# EAGLE design FIDO2AUTH_00211 (EAGLE 7.7.0)

## Sheet 1 of 4
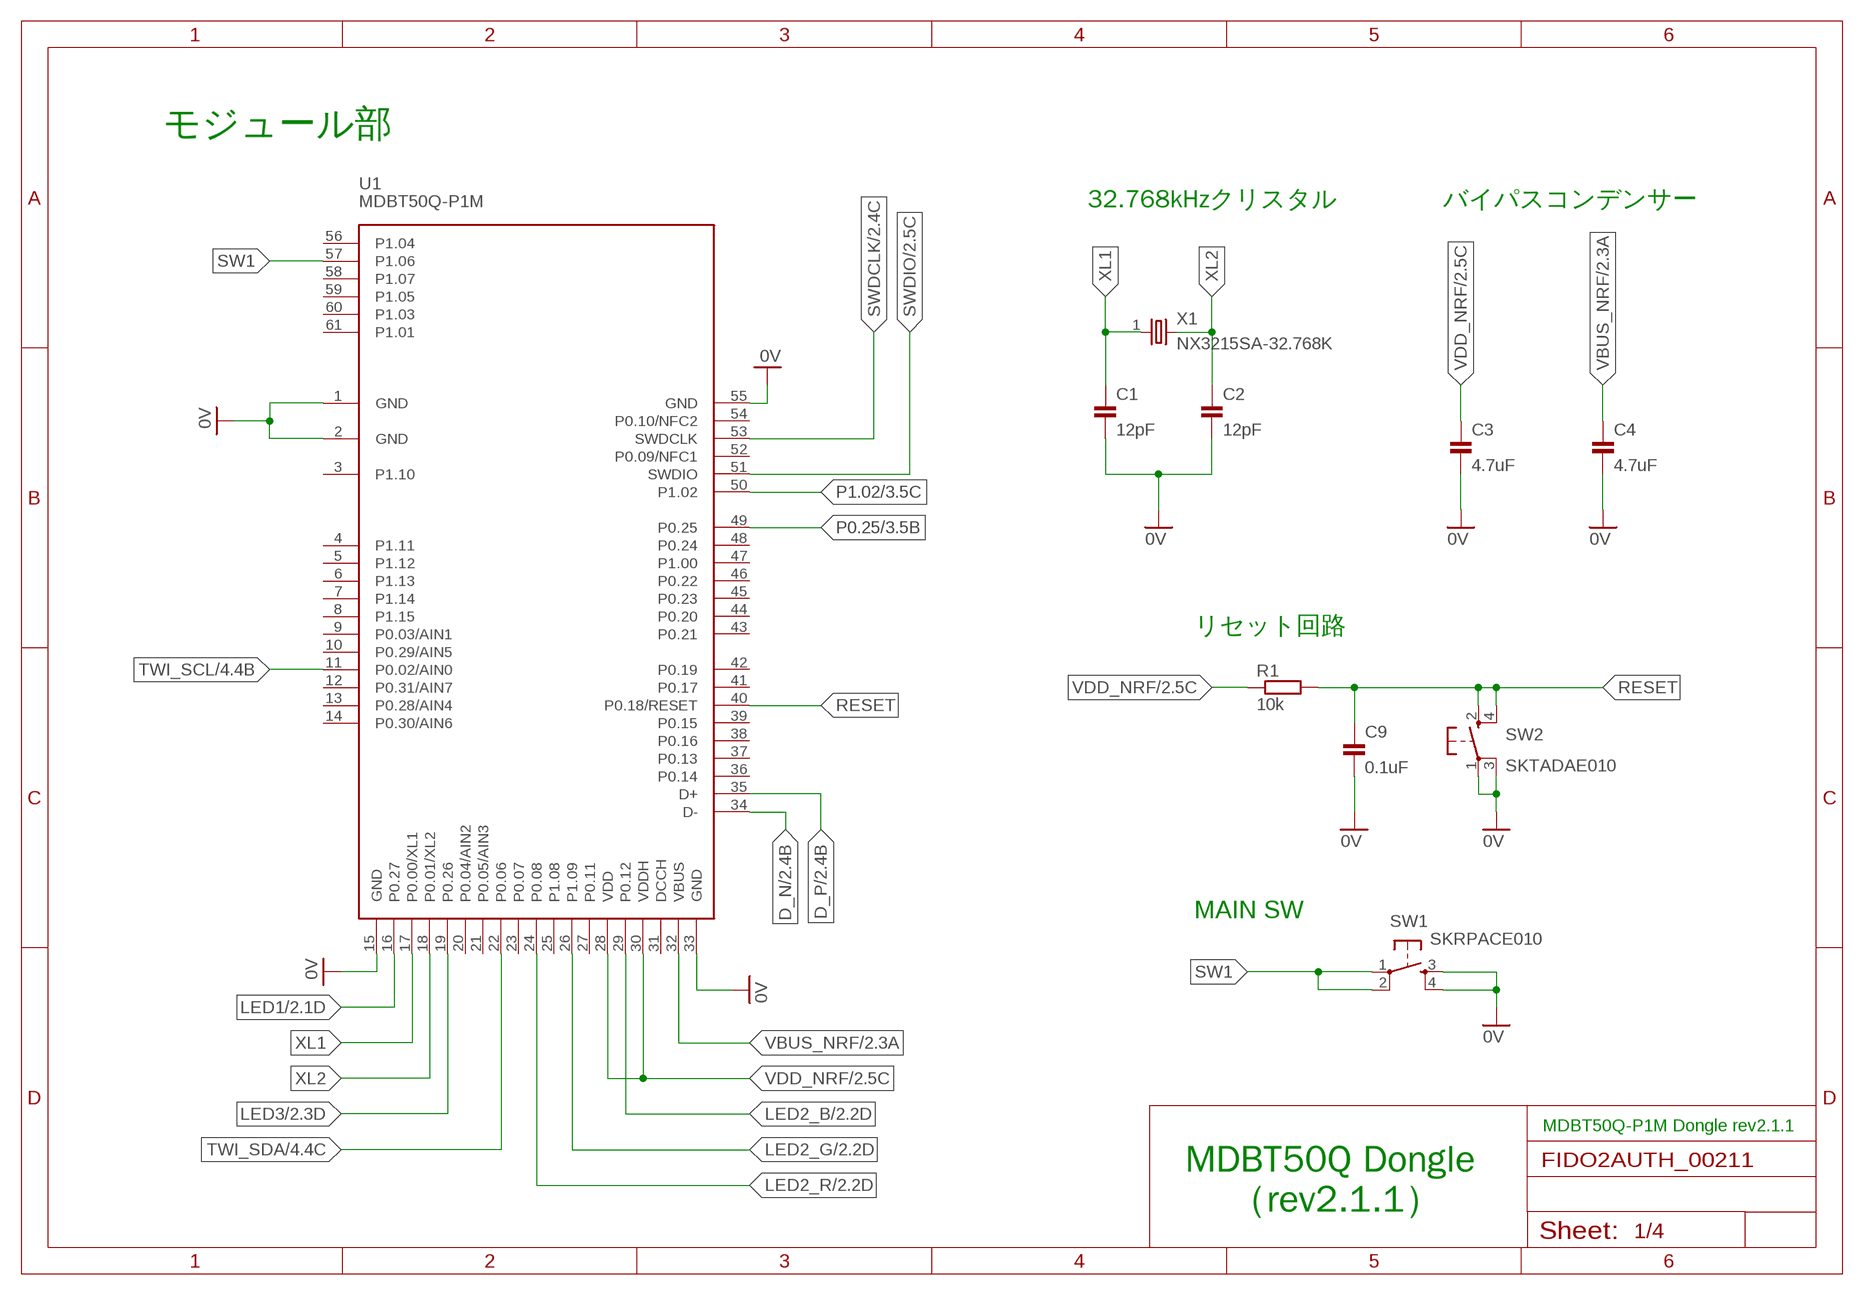
[diagram p0: schematic, sheet 1]

### Parts
C1  12pF  CAP_0603  [C0603K]
C2  12pF  CAP_0603  [C0603K]
C3  4.7uF  CAP_0603  [C0603K]
C4  4.7uF  CAP_0603  [C0603K]
C9  0.1uF  CAP_0402K  [C0402K]
R1  10k  RESISTOR_0402  [R0402]
SW1  SKRPACE010  [SKRPACE010]
SW2  SKTADAE010  [SKTADAE010]
U1  MDBT50Q-P1M  [MDBT50Q-P1M]
X1  NX3215SA-32.768K  [NX3215]

### Nets
0V: C1.2 C2.2 C3.2 C4.2 C9.2 SW1.3(S) SW1.4(S1) SW2.1(P) SW2.3(P1) U1.1(GND) U1.2(GND) U1.15(GND) U1.33(GND) U1.55(GND) ; also sheet 2,3,4
D_N: U1.34(D-) ; also sheet 2
D_P: U1.35(D+) ; also sheet 2
LED1: U1.16(P0.27) ; also sheet 2
LED2_B: U1.29(P0.12) ; also sheet 2
LED2_G: U1.26(P1.09) ; also sheet 2
LED2_R: U1.24(P0.08) ; also sheet 2
LED3: U1.19(P0.26) ; also sheet 2
P0.25: U1.49(P0.25) ; also sheet 3
P1.02: U1.50(P1.02) ; also sheet 3
RESET: C9.1 R1.2 SW2.2(S) SW2.4(S1) U1.40(P0.18/RESET)
SW1: SW1.1(P) SW1.2(P1) U1.57(P1.06)
SWDCLK: U1.53(SWDCLK) ; also sheet 2
SWDIO: U1.51(SWDIO) ; also sheet 2
TWI_SCL: U1.11(P0.02/AIN0) ; also sheet 4
TWI_SDA: U1.22(P0.06) ; also sheet 4
VBUS_NRF: C4.1 U1.32(VBUS) ; also sheet 2,3
VDD_NRF: C3.1 R1.1 U1.28(VDD) U1.30(VDDH) ; also sheet 2,3,4
XL1: C1.1 U1.17(P0.00/XL1) X1.1
XL2: C2.1 U1.18(P0.01/XL2) X1.2
Unconnected: U1.3(P1.10) U1.4(P1.11) U1.5(P1.12) U1.6(P1.13) U1.7(P1.14) U1.8(P1.15) U1.9(P0.03/AIN1) U1.10(P0.29/AIN5) U1.12(P0.31/AIN7) U1.13(P0.28/AIN4) U1.14(P0.30/AIN6) U1.20(P0.04/AIN2) U1.21(P0.05/AIN3) U1.23(P0.07) U1.25(P1.08) U1.27(P0.11) U1.31(DCCH) U1.36(P0.14) U1.37(P0.13) U1.38(P0.16) U1.39(P0.15) U1.41(P0.17) U1.42(P0.19) U1.43(P0.21) U1.44(P0.20) U1.45(P0.23) U1.46(P0.22) U1.47(P1.00) U1.48(P0.24) U1.52(P0.09/NFC1) U1.54(P0.10/NFC2) U1.56(P1.04) U1.58(P1.07) U1.59(P1.05) U1.60(P1.03) U1.61(P1.01)

### Notes on the sheet
- モジュール部
- 32.768kHzクリスタル | バイパスコンデンサー
- リセット回路
- MAIN SW
- MDBT50Q-P1M Dongle rev2.1.1
- MDBT50Q Dongle
      （rev2.1.1）

## Sheet 2 of 4
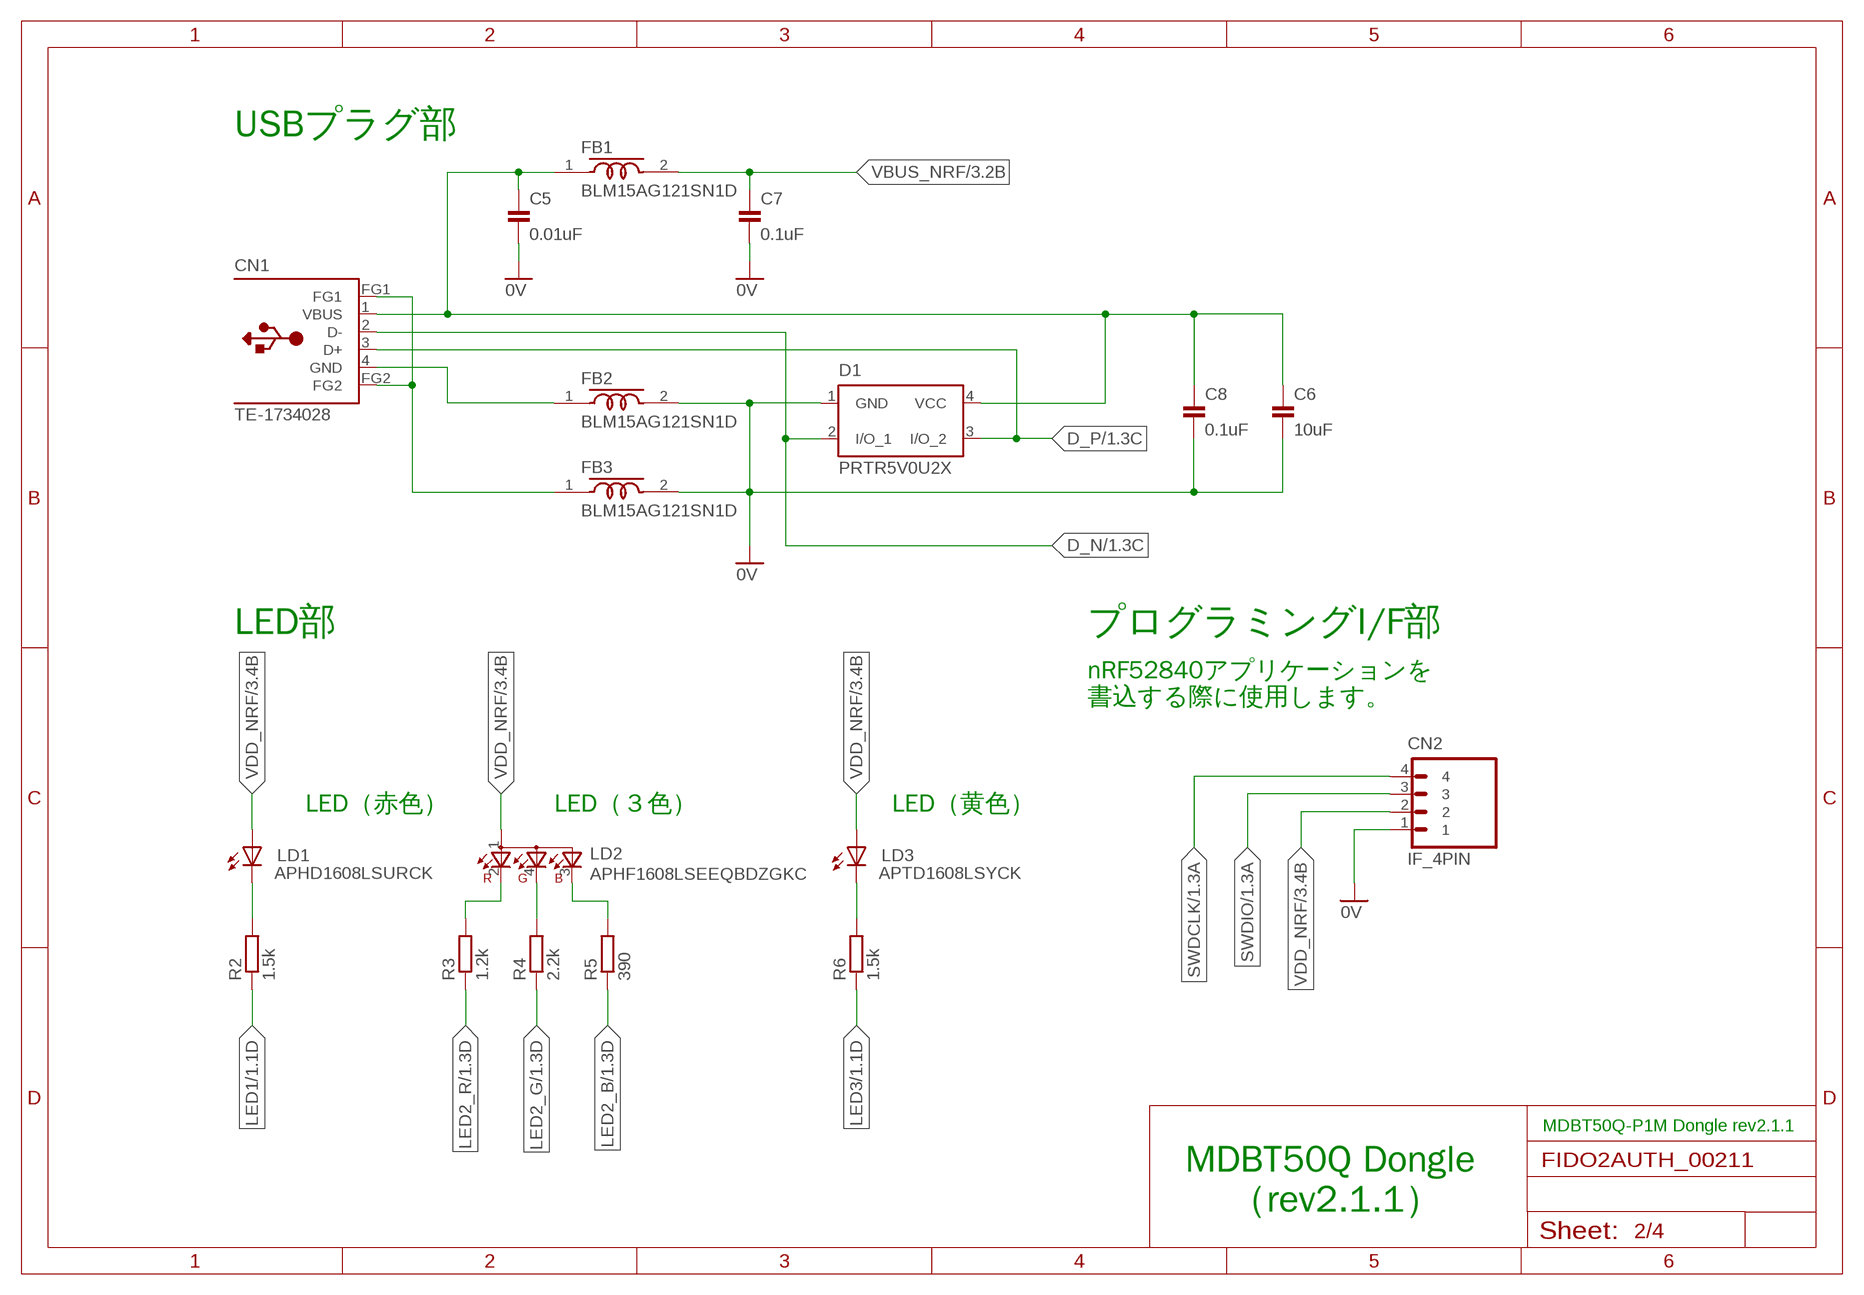
[diagram p1: schematic, sheet 2]

### Parts
C5  0.01uF  CAP_0402K  [C0402K]
C6  10uF  CAP_0603  [C0603K]
C7  0.1uF  CAP_0402K  [C0402K]
C8  0.1uF  CAP_0402K  [C0402K]
CN1  TE-1734028  [TE-1734028]
CN2  IF_4PIN  [HEADER_4PIN]
D1  PRTR5V0U2X  [SOT143B]
FB1  BLM15AG121SN1D  [C0402K]
FB2  BLM15AG121SN1D  [C0402K]
FB3  BLM15AG121SN1D  [C0402K]
LD1  APHD1608LSURCK  [CHIPLED_0603]
LD2  APHF1608LSEEQBDZGKC  [APHF1608LSEEQBDZGKC]
LD3  APTD1608LSYCK  [CHIPLED_0603]
R2  1.5k  RESISTOR_0402  [R0402]
R3  1.2k  RESISTOR_0402  [R0402]
R4  2.2k  RESISTOR_0402  [R0402]
R5  390  RESISTOR_0402  [R0402]
R6  1.5k  RESISTOR_0402  [R0402]

### Nets
0V: C5.2 C6.2 C7.2 C8.2 CN2.1 D1.1(GND) FB2.2 FB3.2 ; also sheet 1,3,4
D_N: CN1.2(D-) D1.2(I/O_1) ; also sheet 1
D_P: CN1.3(D+) D1.3(I/O_2) ; also sheet 1
LED1: R2.1 ; also sheet 1
LED2_B: R5.1 ; also sheet 1
LED2_G: R4.1 ; also sheet 1
LED2_R: R3.1 ; also sheet 1
LED3: R6.1 ; also sheet 1
N$1: LD2.2(CRED) R3.2
N$2: CN1.4(GND) FB2.1
N$3: CN1.FG1 CN1.FG2 FB3.1
N$6: LD2.4(CGREEN) R4.2
N$7: LD2.3(CBLUE) R5.2
N$8: LD3.C R6.2
N$11: LD1.C R2.2
SWDCLK: CN2.4 ; also sheet 1
SWDIO: CN2.3 ; also sheet 1
VBUS: C5.1 C6.1 C8.1 CN1.1(VBUS) D1.4(VCC) FB1.1
VBUS_NRF: C7.1 FB1.2 ; also sheet 1,3
VDD_NRF: CN2.2 LD1.A LD2.1(A) LD3.A ; also sheet 1,3,4

### Notes on the sheet
- USBプラグ部
- LED部 | プログラミングI/F部
- nRF52840アプリケーションを
  書込する際に使用します。
- LED（赤色） | LED（３色） | LED（黄色）
- MDBT50Q-P1M Dongle rev2.1.1
- MDBT50Q Dongle
      （rev2.1.1）

## Sheet 3 of 4
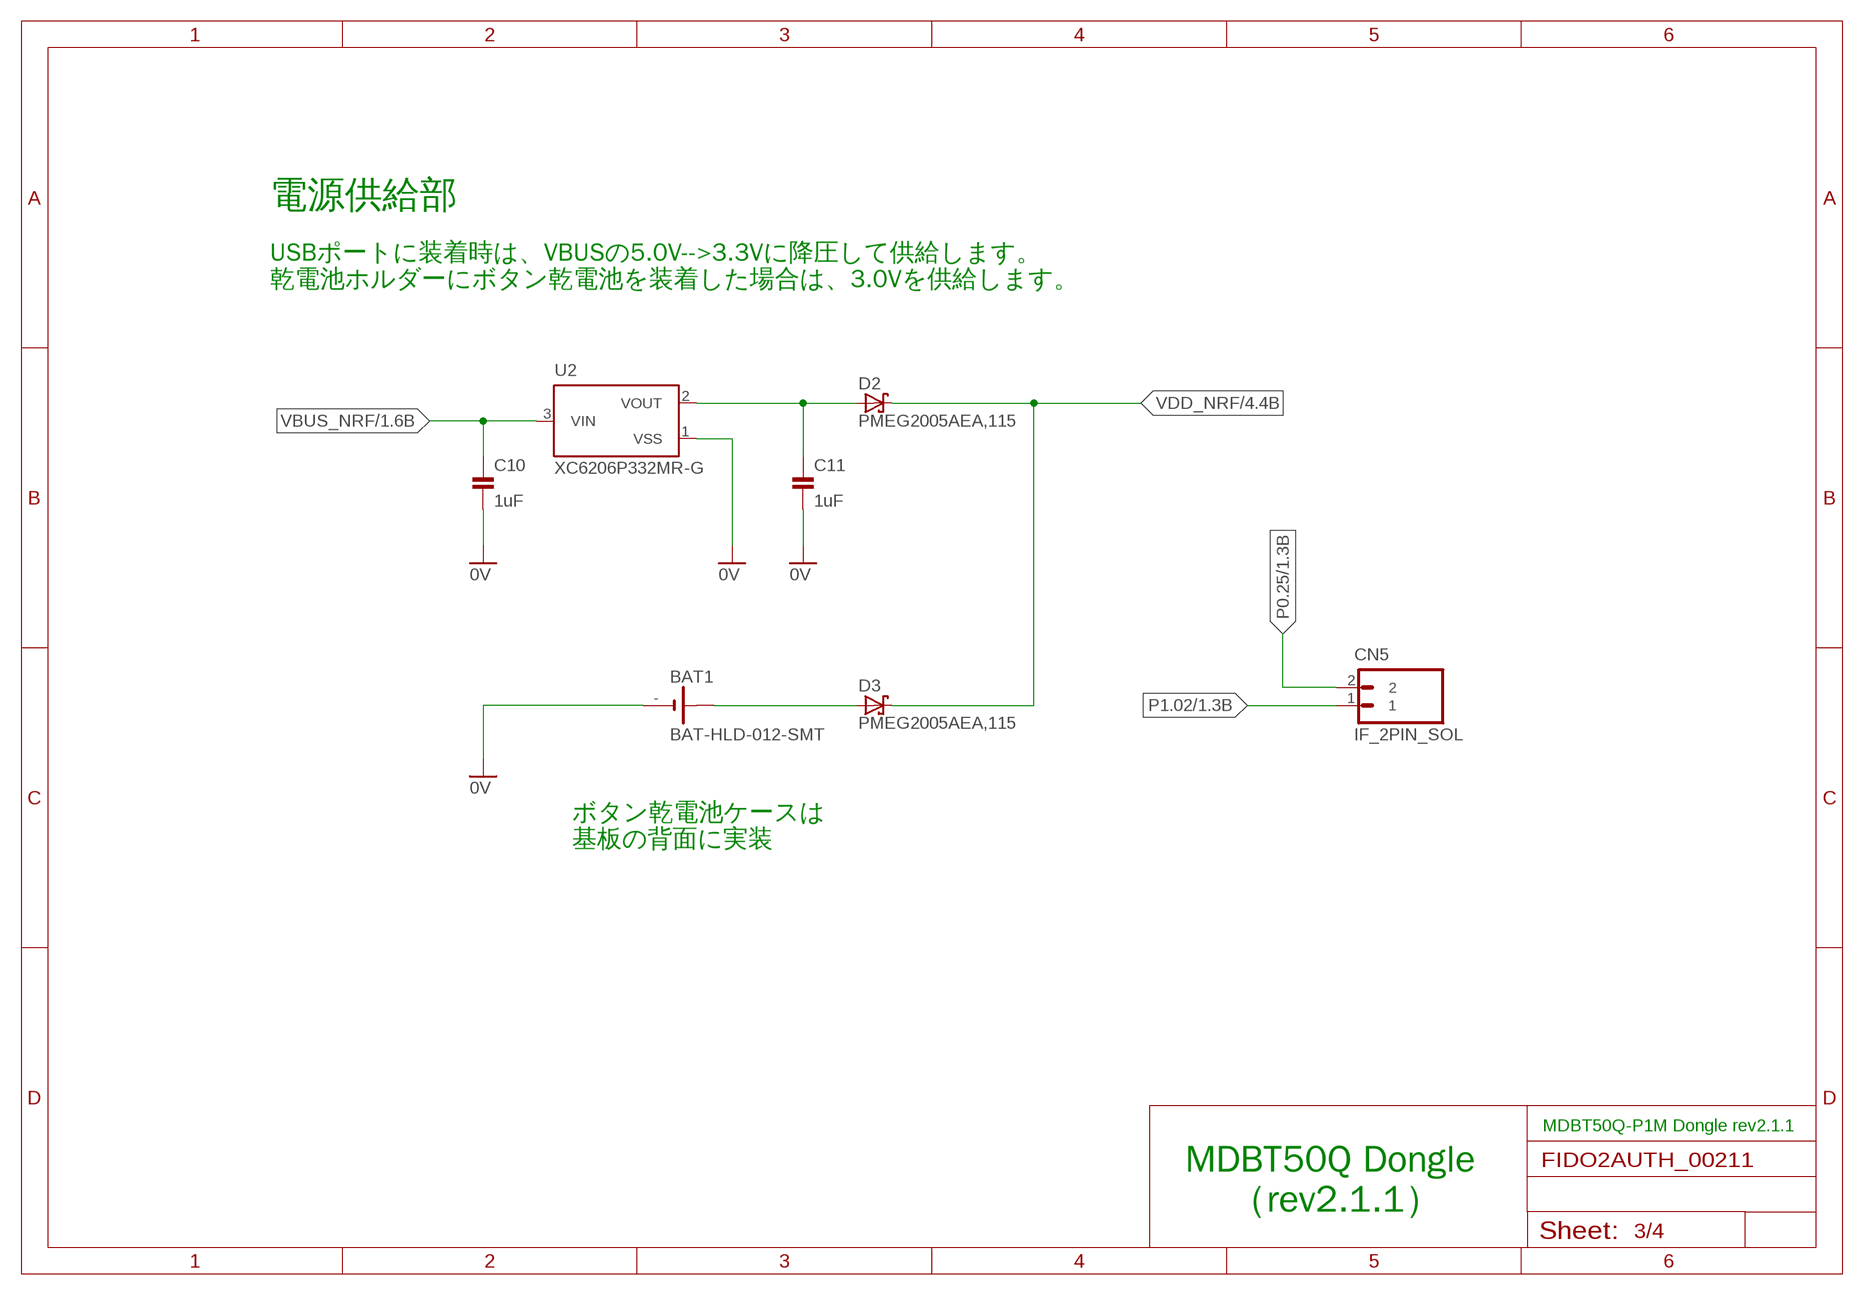
[diagram p2: schematic, sheet 3]

### Parts
BAT1  BAT-HLD-012-SMT  [BAT-HLD-012-SMT]
C10  1uF  CAP_0603  [C0603K]
C11  1uF  CAP_0603  [C0603K]
CN5  IF_2PIN_SOL  [SOLPAD_2PIN]
D2  PMEG2005AEA,115  [SOD323-W]
D3  PMEG2005AEA,115  [SOD323-W]
U2  XC6206P332MR-G  [SOT23]

### Nets
0V: BAT1.- C10.2 C11.2 U2.1(VSS) ; also sheet 1,2,4
N$4: C11.1 D2.A U2.2(VOUT)
N$5: BAT1.+@1(+) D3.A
P0.25: CN5.2 ; also sheet 1
P1.02: CN5.1 ; also sheet 1
VBUS_NRF: C10.1 U2.3(VIN) ; also sheet 1,2
VDD_NRF: D2.C D3.C ; also sheet 1,2,4

### Notes on the sheet
- 電源供給部
- USBポートに装着時は、VBUSの5.0V-->3.3Vに降圧して供給します。
  乾電池ホルダーにボタン乾電池を装着した場合は、3.0Vを供給します。
- ボタン乾電池ケースは
  基板の背面に実装
- MDBT50Q-P1M Dongle rev2.1.1
- MDBT50Q Dongle
      （rev2.1.1）

## Sheet 4 of 4
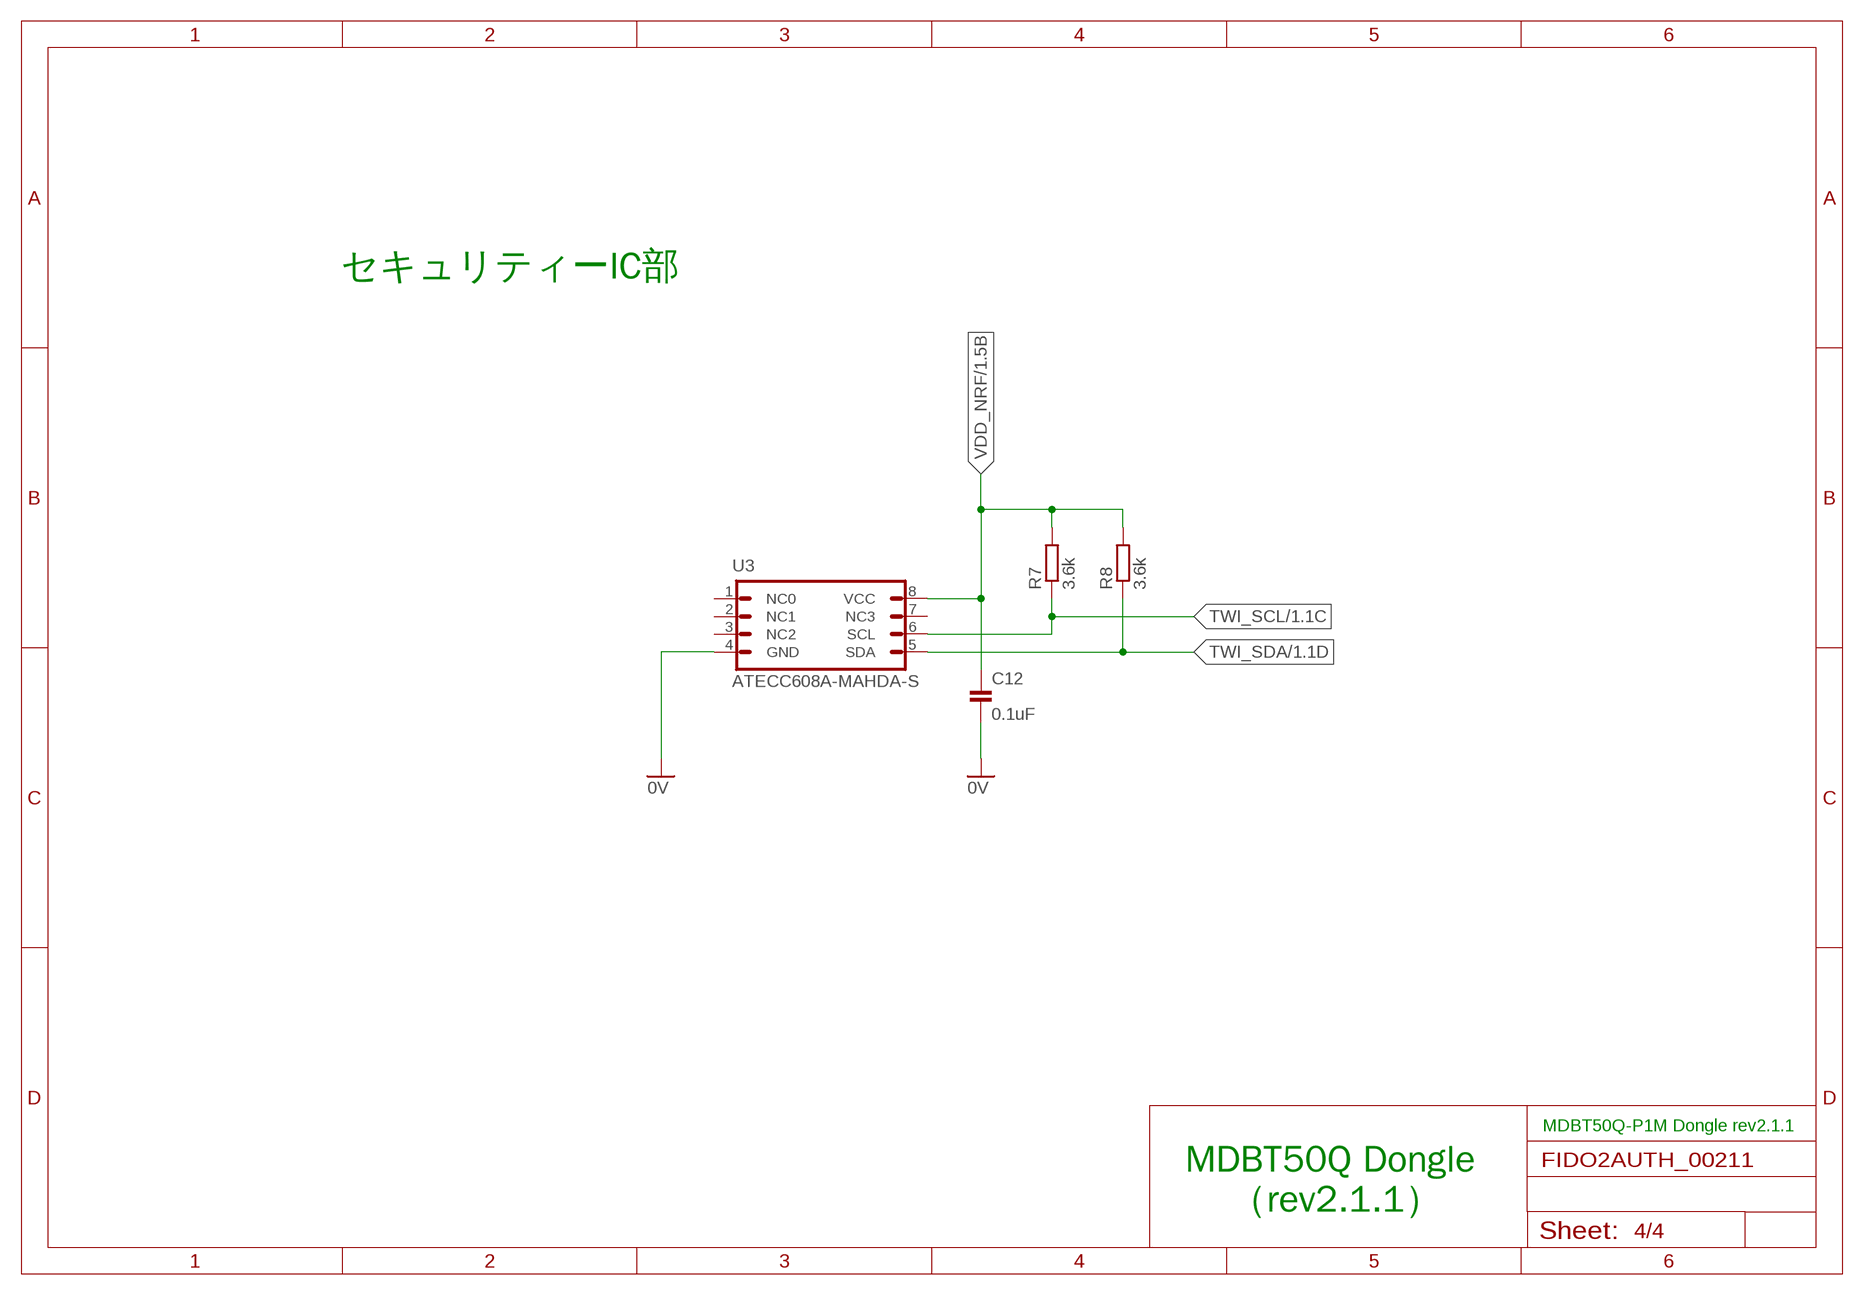
[diagram p3: schematic, sheet 4]

### Parts
C12  0.1uF  CAP_0402K  [C0402K]
R7  3.6k  RESISTOR_0402  [R0402]
R8  3.6k  RESISTOR_0402  [R0402]
U3  ATECC608A-MAHDA-S  [DFN-2X3]

### Nets
0V: C12.2 U3.4(GND) ; also sheet 1,2,3
TWI_SCL: R7.1 U3.6(SCL) ; also sheet 1
TWI_SDA: R8.1 U3.5(SDA) ; also sheet 1
VDD_NRF: C12.1 R7.2 R8.2 U3.8(VCC) ; also sheet 1,2,3
Unconnected: U3.1(NC0) U3.2(NC1) U3.3(NC2) U3.7(NC3)

### Notes on the sheet
- セキュリティーIC部
- MDBT50Q-P1M Dongle rev2.1.1
- MDBT50Q Dongle
      （rev2.1.1）

## Library data of the parts
BAT1 = Connectors:BAT-HLD-012-SMT: ボタン電池ホルダー(CR1216/1225)
C1-C12 = Parts:CAP: コンデンサー
CN1 = Connectors:TE-1734028: USB connector plug TE Connectivity
CN2 = Connectors:IF_4PIN: 4-pin インターフェース
CN5 = Connectors:IF_2PIN: 2-pin インターフェース
D1 = Parts:PRTR5V0U2X: ESD protection diode
D2 D3 = Parts:PMEG2005: ショットキーダイオード If - 順電流: 500 mA Vrrm - 繰返し逆電圧: 20 V Vf - 順電圧: 0.39 V Ifsm - 順方向サージ電流: 10 A 最低動作温度: - 65 C 最高動作温度: + 150 C
FB1-FB3 = Parts:BLM15AG: フェライトビーズ EMIFIL®
LD1 = Parts:APHD1608: 発光ダイオード
LD2 = Parts:APHF1608: Chip LED RGB Source: http://document.sharpsma.com/files/GM1WA55311A_SS.pdf
LD3 = Parts:APTD1608: 発光ダイオード
R1-R8 = Parts:RESISTOR: 抵抗器
SW1 = Parts:SKRPACE010: 表面実装用タクトスイッチ ４．２×３．２ｍｍ小型重作動力タイプ ・作動力：２．５５Ｎ ・操作方向：垂直 ・移動量：０．２ｍｍ ・動作寿命：５０，０００ｃｙｃｌｅｓ （５ｍＡ ５ＶＤＣ） ・初期接触抵抗：最大５００ｍΩ
SW2 = Parts:SKTADAE010: 表面実装用タクトスイッチ 2.6×1.6ｍｍ小型重作動力タイプ ・作動力：2.4 N ・操作方向：垂直 ・移動量：0.11 mm ・定格：50 mA 12 VDC
U1 = Modules:MDBT50Q-P1M: MDBT50Q – P1M (PCB Antenna) Bluetooth 5, IEEE 802.15.4, 2.4 GHz transceiver ARM Cortex –M4 32-bit processor with FPU, 64 MHz Memory: 1MB flash / 256KB RAM ‧Supply voltage range 1.7V to 5.5V ‧On-chip DC/DC and LDO regulators with automated low current modes ‧Regulated supply for external components from 1.8V to 3.3V ‧0.4uA at 3V in System OFF mode, no RAM retention ‧1.5uA at 3V in System ON mode, no RAM retention, wake on RTC Working distance 1Mbps: up to 250 meters in open space 2Mbps: up to 120 meters in open space
U2 = Parts:XC6206: LDO電圧レギュレータ 出力電圧: 3.3 V 出力電流: 200 mA 入力電圧最大値: 6 V 最小入力電圧: 1.8 V 動作供給電流: 1 uA 最低動作温度: - 40 C 最高動作温度: + 85 C
U3 = ICs:ATECC608A: high-security cryptographic device 供給電圧: 2 〜 5.5 V 動作温度: - 40 C 〜 + 85 C 供給電流 - 最大: 14 mA 動作供給電流: 2 mA
X1 = Parts:NX3215SA: 水晶振動子 周波数 32.768kHz 周波数公差 ±20ppm 負荷容量 6pF ESR（等価直列抵抗） 70 kOhms 動作温度 -40°C～85°C

## Board
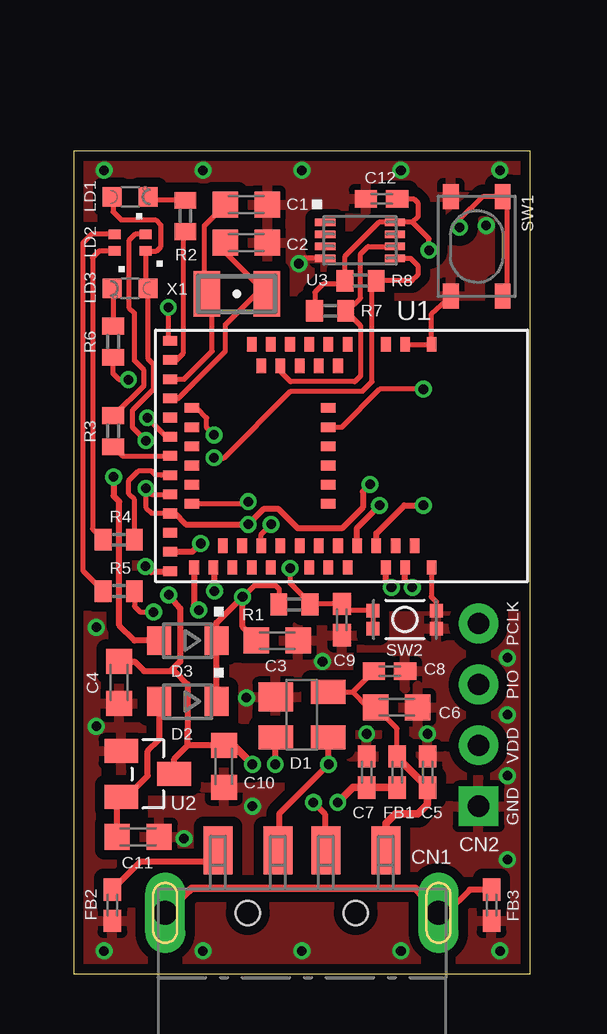
[diagram p4: board, top side]
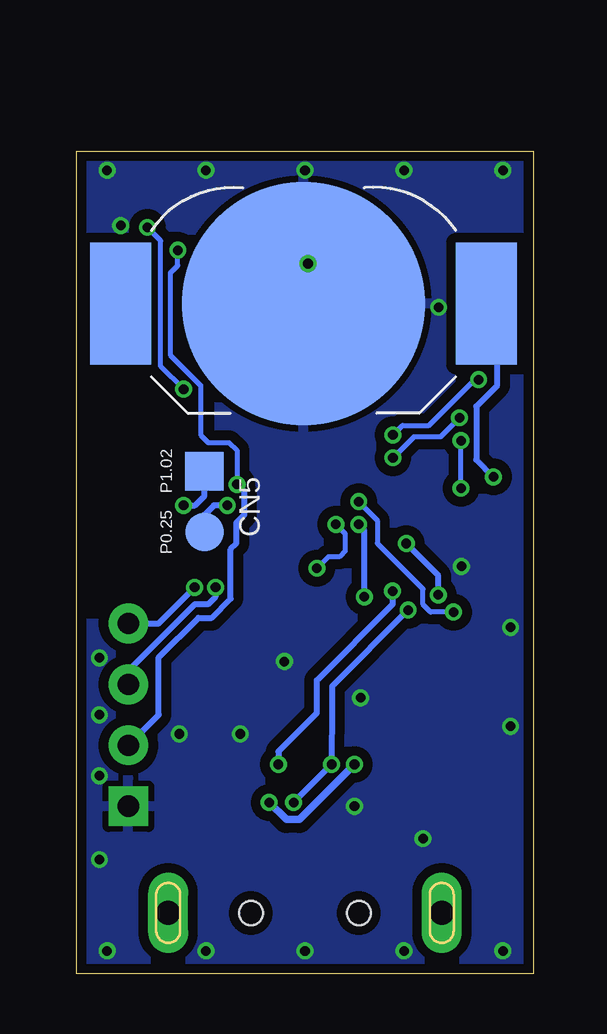
[diagram p5: board, bottom side, seen from below]

Size 19.05 x 34.29 mm. Coordinates in mm from the lower left corner, seen from the top.
Outline: 0,0 19.05,0 19.05,34.29 0,34.29 0,0
Copper layers (1*16): Top 0.035mm / dielectric 1.5mm / Bottom 0.035mm
Design rules "SeeedStudio_2layer_DRU_no_angle_20140221": minimum track width 6mil, minimum drill 12mil, track to track 6mil, track to pad 6mil, pad to pad 6mil, via to via 6mil, smd to smd 0mil, copper to edge 10mil, drill to drill 10mil, minimum pad ring 10mil, minimum via ring 6mil, stop-mask expansion 2mil, vias tented up to drill 100mil, thermal gap 10mil

### Footprints (pad centres in the part's own frame; a part is rotated, then mirrored left to right if it is on the bottom)
BAT-HLD-012-SMT = smd 2.54 x 5.08: +@1 -7.62,0; +@2 7.62,0 | smd 10.16 x 10.16: - 0,0
C0603K = smd 1.05 x 1.08: 1 -0.875,0; 2 0.875,0
C0402K = smd 0.925 x 0.74: 1 -0.65,0; 2 0.65,0
TE-1734028 = smd 1.2 x 2: 1 3.5,2.6; 2 1,2.6; 3 -1,2.6; 4 -3.5,2.6 | drill 1 pad 1.676 long: FG1 5.7,0; FG2 -5.7,0 | hole 1: -2.25,0; 2.25,0
HEADER_4PIN = drill 0.889 pad 1.651 square: 1 0,0 | drill 0.889 pad 1.651: 2 2.54,0; 3 5.08,0; 4 7.62,0
SOLPAD_2PIN = smd 1.6 x 1.6: 1 0,0; 2 2.54,0
SOT143B = smd 1.2 x 1.44: 1 -0.75,-1.1 | smd 1 x 1.44: 2 0.95,-1.1; 3 0.95,1.1; 4 -0.95,1.1
SOD323-W = smd 1 x 1.2: A 1.2,0; C -1.2,0
CHIPLED_0603 = smd 0.8 x 0.8: A -0.75,0; C 0.75,0
APHF1608LSEEQBDZGKC = smd 0.5 x 0.4: 1 -0.65,0.35; 2 -0.65,-0.35; 3 0.65,-0.35; 4 0.65,0.35
R0402 = smd 0.7 x 0.9: 1 -0.65,0; 2 0.65,0
SKRPACE010 = smd 1.05 x 0.65: 1 -2.075,1.075; 2 2.075,1.075; 3 -2.075,-1.075; 4 2.075,-1.075
SKTADAE010 = smd 0.55 x 0.55: 1 -1.325,0.375; 2 1.325,0.375; 3 -1.325,-0.375; 4 1.325,-0.375
MDBT50Q-P1M = smd 0.6 x 0.4: 1 -4.65,3.75; 2 -4.65,2.65; 3 -4.65,1.85; 4 -4.65,0.25; 5 -3.75,-0.15; 6 -4.65,-0.55; 7 -3.75,-0.95; 8 -4.65,-1.35; 9 -3.75,-1.75; 10 -4.65,-2.15; 11 -3.75,-2.55; 12 -4.65,-2.95; 13 -3.75,-3.35; 14 -4.65,-3.75; 34 4.65,-6.15; 35 4.65,-5.35; 36 3.75,-4.95; 37 4.65,-4.55; 38 3.75,-4.15; 39 4.65,-3.75; 40 3.75,-3.35; 41 4.65,-2.95; 42 3.75,-2.55; 43 3.75,-1.75; 44 4.65,-1.35; 45 3.75,-0.95; 46 4.65,-0.55; 47 3.75,-0.15; 48 4.65,0.25; 49 3.75,0.65; 50 3.75,1.45; 51 4.65,1.85; 52 3.75,2.25; 53 4.65,2.65; 54 3.75,3.05; 55 4.65,3.75 | smd 0.4 x 0.6: 15 -4.8,-7.15; 16 -4,-7.15; 17 -3.2,-7.15; 18 -2.4,-7.15; 19 -2,-6.25; 20 -1.6,-7.15; 21 -1.2,-6.25; 22 -0.8,-7.15; 23 -0.4,-6.25; 24 0,-7.15; 25 0.4,-6.25; 26 0.8,-7.15; 27 1.2,-6.25; 28 1.6,-7.15; 29 2,-6.25; 30 2.4,-7.15; 31 3.2,-7.15; 32 4,-7.15; 33 4.8,-7.15; 56 -2,-0.55; 57 -1.2,-0.55; 58 -0.4,-0.55; 59 0.4,-0.55; 60 1.2,-0.55; 61 2,-0.55
SOT23 = smd 1 x 1.4: 1 -0.95,-1.1; 2 0.95,-1.1; 3 0,1.1
DFN-2X3 = smd 0.3 x 0.85: 1 -0.75,-1.45; 2 -0.25,-1.45; 3 0.25,-1.45; 4 0.75,-1.45; 5 0.75,1.45; 6 0.25,1.45; 7 -0.25,1.45; 8 -0.75,1.45
NX3215 = smd 1.1 x 1.9: 1 -1.25,0; 2 1.25,0

### Placement (x,y rotation side)
BAT1  9.59,27.94 180 bottom
C1  7.21,32.07 0 top
C2  7.21,30.48 0 top
C3  8.49,13.89 0 top
C4  1.91,12.14 270 top
C5  14.76,8.41 90 top
C6  13.48,11.11 0 top
C7  12.22,8.41 90 top
C8  13.18,12.62 0 top
C9  11.19,14.76 270 top
C10  6.27,8.65 270 top
C11  2.7,5.71 0 top
C12  12.84,32.31 180 top
CN1  9.53,2.54 0 top
CN2  16.89,6.99 90 top
CN5  13.72,20.95 270 bottom
D1  9.53,10.79 270 top
D2  4.76,11.35 180 top
D3  4.76,13.89 180 top
FB1  13.49,8.41 270 top
FB2  1.62,2.86 270 top
FB3  17.43,2.86 270 top
LD1  2.37,32.38 0 top
LD2  2.37,30.48 180 top
LD3  2.37,28.57 180 top
R1  9.21,15.4 0 top
R2  4.67,31.59 90 top
R3  1.65,22.62 90 top
R4  1.89,18.1 180 top
R5  1.89,15.95 180 top
R6  1.65,26.35 90 top
R7  10.7,27.64 180 top
R8  11.97,28.89 180 top
SW1  16.81,30.32 270 top
SW2  13.81,14.76 180 top
U1  11.18,21.59 270 top
U2  3.1,8.33 270 top
U3  11.95,30.58 270 top
X1  6.81,28.34 0 top

### Tracks (layer width: path | path; a pad name or v marks a point on that pad's centre or on a via)
0V  (via drill 0.4)
  Top 0.203: 4.06,26.35 U1.15 3.95,26.46 v3.95,27.78 | U1.2 U1.1 14.93,27.52 SW1.4 | SW2.3 15.14,15.5 14.92,15.72 14.93,15.72 U1.55 | 3.98,16.75 U1.33 | U3.4 9.62,29.82 v9.4,29.61
  Top 0.254: 3.98,16.75 3.24,16.75 v3,16.99
  other vias: 9.53,0.95 10.38,13.02 13.65,0.95 5.4,0.95 4.6,5.64 18.1,4.76 18.1,10.79 17.78,0.95 1.27,0.95 7.46,6.99 18.1,13.18 7.21,11.51 1.27,33.5 18.1,8.26 17.21,31.19 5.4,33.5 9.53,33.5 17.78,33.5 13.65,33.5 12.22,10 14.76,10 0.95,10.32 0.95,14.45
  pour Bottom (isolate 0.406, rank 3): -2.54,-2.54 21.59,-2.54 21.59,14.61 14.35,14.61 14.35,21.59 13.08,21.59 13.08,24.77 14.35,24.77 14.35,28.57 21.59,28.57 21.59,36.83 -2.54,36.83
  pour Top (isolate 0.406, rank 3): -1.27,35.56 20.32,35.56 20.32,28.26 2.92,28.26 2.92,14.92 20.32,14.92 20.32,-1.27 -1.27,-1.27
D_N  (via drill 0.4)
  Top 0.254: CN1.2 10.48,5.19 10.48,6.67 v10,7.14 | v8.41,8.73 8.41,9.83 D1.2 | U1.34 5.03,15.36 v5.22,15.16
  Bottom 0.254: v10,7.14 v8.41,8.73 8.4,11.19 8.4,11.99 v5.22,15.16
D_P  (via drill 0.4)
  Top 0.254: CN1.3 8.57,5.19 8.57,6.67 v10.64,8.73 10.64,9.83 D1.3 | v5.87,15.95 5.87,16.89 U1.35
  Bottom 0.254: v10.64,8.73 10.64,9.27 9.03,10.87 9.03,12.24 5.87,15.4 v5.87,15.95
LED1
  Top 0.203: U1.16 4.3,25.59 4.59,25.88 4.59,30.86 R2.1
LED2_B  (via drill 0.4)
  Top 0.203: 4.94,19.61 U1.29 7.19,19.59 v7.29,19.68 | R5.1 2.54,15.32 2.78,15.08 v3.33,15.08
  Bottom 0.203: v7.29,19.68 6.51,18.91 6.51,17.94 4.6,16.03 4.6,15.4 4.29,15.08 v3.33,15.08
LED2_G
  Top 0.203: R4.1 2.54,19.77 2.3,20 2.3,20.56 2.7,20.95 3.25,20.95 3.41,20.8 3.65,20.8 3.66,20.79 U1.26
  Top 0.254: U1.26
LED2_R
  Top 0.203: R3.1 2.03,21.59 U1.24
LED3  (via drill 0.4)
  Top 0.203: 1.57,25.56 R6.1 1.65,25.02 1.91,24.77 v2.29,24.77 | 5.24,23.5 5.02,23.5 U1.19 5.14,23.59 5.56,23.18 5.56,22.77 v5.86,22.46
  Bottom 0.203: v5.86,22.46 5.46,22.86 4.35,22.86 2.44,24.77 v2.29,24.77
N$1
  Top 0.203: LD2.2 2.57,30.83 2.3,30.56 2.3,27.78 2.54,27.54 2.54,25.56 2.94,25.16 2.94,24.53 1.68,23.27 R3.2
N$2
  Top 0.254: CN1.4 5.63,4.68 2.79,4.68 FB2.1
N$3
  Top 0.254: FB3.1 16.52,3.51 15.56,2.54 CN1.FG1
  Top 0.305: CN1.FG2 4.92,3.57 14.26,3.57 CN1.FG1
N$4
  Top 0.254: D2.A 3.56,9.75 3.1,9.29 3.1,8.26 2.23,7.38 U2.2 1.82,7.21 C11.1
N$5  (via drill 0.4)
  Top 0.254: D3.A 2.54,13.89 1.91,14.53 1.91,19.68 1.67,19.92 v1.67,20.72
  Bottom 0.254: 1.67,27.64 BAT1.+@1 1.51,27.48 1.51,24.53 2.38,23.65 2.38,21.43 v1.67,20.72
N$6
  Top 0.203: LD2.4 1.08,30.13 0.79,29.84 0.79,18.54 R4.2
N$7
  Top 0.203: LD2.3 0.75,30.83 0.4,30.48 0.4,16.8 R5.2
N$8
  Top 0.203: LD3.C 1.65,28.54 R6.2
N$11
  Top 0.203: R2.2 3.26,32.24 LD1.C
P0.25  (via drill 0.4)
  Top 0.254: U1.49 11.83,18.59 v12.76,19.53
  Bottom 0.254: 13.08,18.41 CN5.2 13.72,19.13 13.32,19.53 v12.76,19.53
P1.02  (via drill 0.4)
  Top 0.254: U1.50 12.63,18.36 13.79,19.53 v14.59,19.53
  Bottom 0.254: v14.59,19.53 14.11,19.53 13.72,19.92 CN5.1
RESET  (via drill 0.4)
  Top 0.203: v9.03,16.91 9.03,16.29 9.86,15.46 R1.2 9.87,15.41 C9.1 11.47,15.14 SW2.4 SW2.2 | U1.40 7.83,18.32 v8.24,18.73
  Top 0.254: 7.84,17.86 U1.40
  Bottom 0.203: v8.24,18.73 7.84,18.34 7.84,17.64 8.1,17.38 8.56,17.38 v9.03,16.91
SW1  (via drill 0.4)
  Top 0.203: v14.59,24.37 12.76,24.37 11.19,22.79 U1.57 | SW1.2 18.08,28.52 18.08,32.28 SW1.1 17.06,32.4 16.1,31.43 v16.1,31.11
  Bottom 0.203: v14.59,24.37 15.54,25.32 15.54,30.56 v16.1,31.11
SWDCLK  (via drill 0.4)
  Top 0.254: v14.13,16.11 13.83,16.42 U1.53
  Bottom 0.254: CN2.4 15.64,14.61 v14.13,16.11
SWDIO  (via drill 0.4)
  Top 0.254: v13.26,16.11 13.03,16.34 U1.51
  Bottom 0.254: v13.26,16.11 13.26,15.72 13.57,15.4 14.13,15.4 16.89,12.64 CN2.3
TWI_SCL
  Top 0.203: U3.6 12.29,30.32 11.97,30 11.97,28.18 11.43,27.64 R7.1 11.97,27.02 11.97,24.92 11.73,24.69 9.05,24.69 8.63,25.11 U1.11
TWI_SDA  (via drill 0.4)
  Top 0.203: U1.22 3.87,22.39 v3.08,23.18 | 12.45,28.56 R8.1 | R8.1 12.45,28.72 12.45,24.69 12.05,24.29 9.05,24.29 6.27,21.51 v5.86,21.51 | U3.5 14.05,29.82 14.35,29.53 14.35,29.13 14.11,28.89 R8.1
  Top 0.254: U1.22
  Bottom 0.203: v3.08,23.18 3.87,22.38 4.99,22.38 v5.86,21.51
VBUS
  Top 0.203: D1.4 11.65,11.74 | 11.65,11.74 C8.1 | 11.65,11.74 12.28,11.11 C6.1 13.49,10.22 FB1.1
  Top 0.305: FB1.1 13.49,9.05 14.76,7.78 C5.1 14.76,7.06 14.37,6.67 13.41,6.67 13.03,6.28 CN1.1
VBUS_NRF  (via drill 0.4)
  Top 0.254: U2.3 4.2,8.96 4.76,9.53 | C10.1 4.76,9.53 | C4.1 2.54,13.02 2.94,12.62 4.05,12.62 | 4.05,12.62 4.21,12.62 4.76,12.06 4.76,10.24 4.76,9.53 | 4.05,12.62 4.45,13.02 4.45,15.24 v3.97,15.8 | v5.3,17.94 4.95,17.59 U1.32
  Top 0.305: C10.1 6.67,9.53 v7.46,8.73 | FB1.2 C7.1 12.16,7.7 12.08,7.78 11.65,7.78 v11.02,7.14
  Bottom 0.254: v3.97,15.8 3.97,16.61 v5.3,17.94
  Bottom 0.305: v7.46,8.73 9.76,6.43 10.3,6.43 v11.02,7.14
VDD_NRF  (via drill 0.4)
  Top 0.203: LD1.A 1.65,32.27 1.65,31.77 1.98,31.43 3.41,31.43 3.65,31.19 3.65,30.32 3.46,30.13 LD2.1 3.02,28.68 LD3.A 3.12,25.62 3.33,25.4 3.33,24.37 2.46,23.5 2.46,22.78 v3.02,22.23 | R7.2 10.06,27.65 10.06,28.42 10.4,28.75 11.34,28.75 R8.2 11.32,29.91 12.74,31.32 U3.8 14.14,31.32 | v14.83,30.16 14.83,30.64 14.14,31.32 | C12.1 14.19,32.31 14.35,32.15 14.35,31.54 14.14,31.32 | v7.05,15.72 7.06,15.72 7.54,16.19 8.41,16.19 8.57,16.03 8.57,15.41 R1.1 | U1.30 3.27,19.19 3.02,19.45 v3.02,20.24 3.27,19.99 U1.28
  Top 0.254: 4.13,19.19 U1.30 4.23,19.19 4.68,18.73 v7.29,18.73 7.92,19.37 8.56,19.37 9.35,18.57 11.19,18.57 12.06,19.45 12.06,20.1 v12.37,20.4 | D2.C D3.C 5.96,14.63 v7.05,15.72 7.05,14.46 C3.1
  Bottom 0.203: v14.83,30.16 14.83,29.53 15.14,29.21 15.14,25.8 13.88,24.53 13.88,22.46 13.56,22.15 12.68,22.15 12.37,21.83 v12.37,20.4 | v3.02,20.24 v3.02,22.23
  Bottom 0.254: CN2.2 15.62,10.79 15.62,13.19 13.97,14.84 13.41,14.84 12.62,15.64 12.62,17.7 12.38,17.94 12.38,18.81 12.06,19.13 12.06,20.1 v12.37,20.4 | v7.05,15.72 7.05,18.49 v7.29,18.73
XL1
  Top 0.203: U1.17 4.61,24.79 5.78,25.96 5.78,28.12 X1.1 5.46,28.44 5.46,31.2 C1.1
XL2
  Top 0.203: U1.18 4.37,23.99 6.33,25.96 6.33,27.07 7.6,28.34 X1.2 6.33,30.07 C2.1

### Text on the board
tPlace: PCLK | PIO | VDD | GND
bPlace: P1.02 | P0.25